# Altium schematic sheet 01.LemonAutopilot_1.SchDoc
size A4
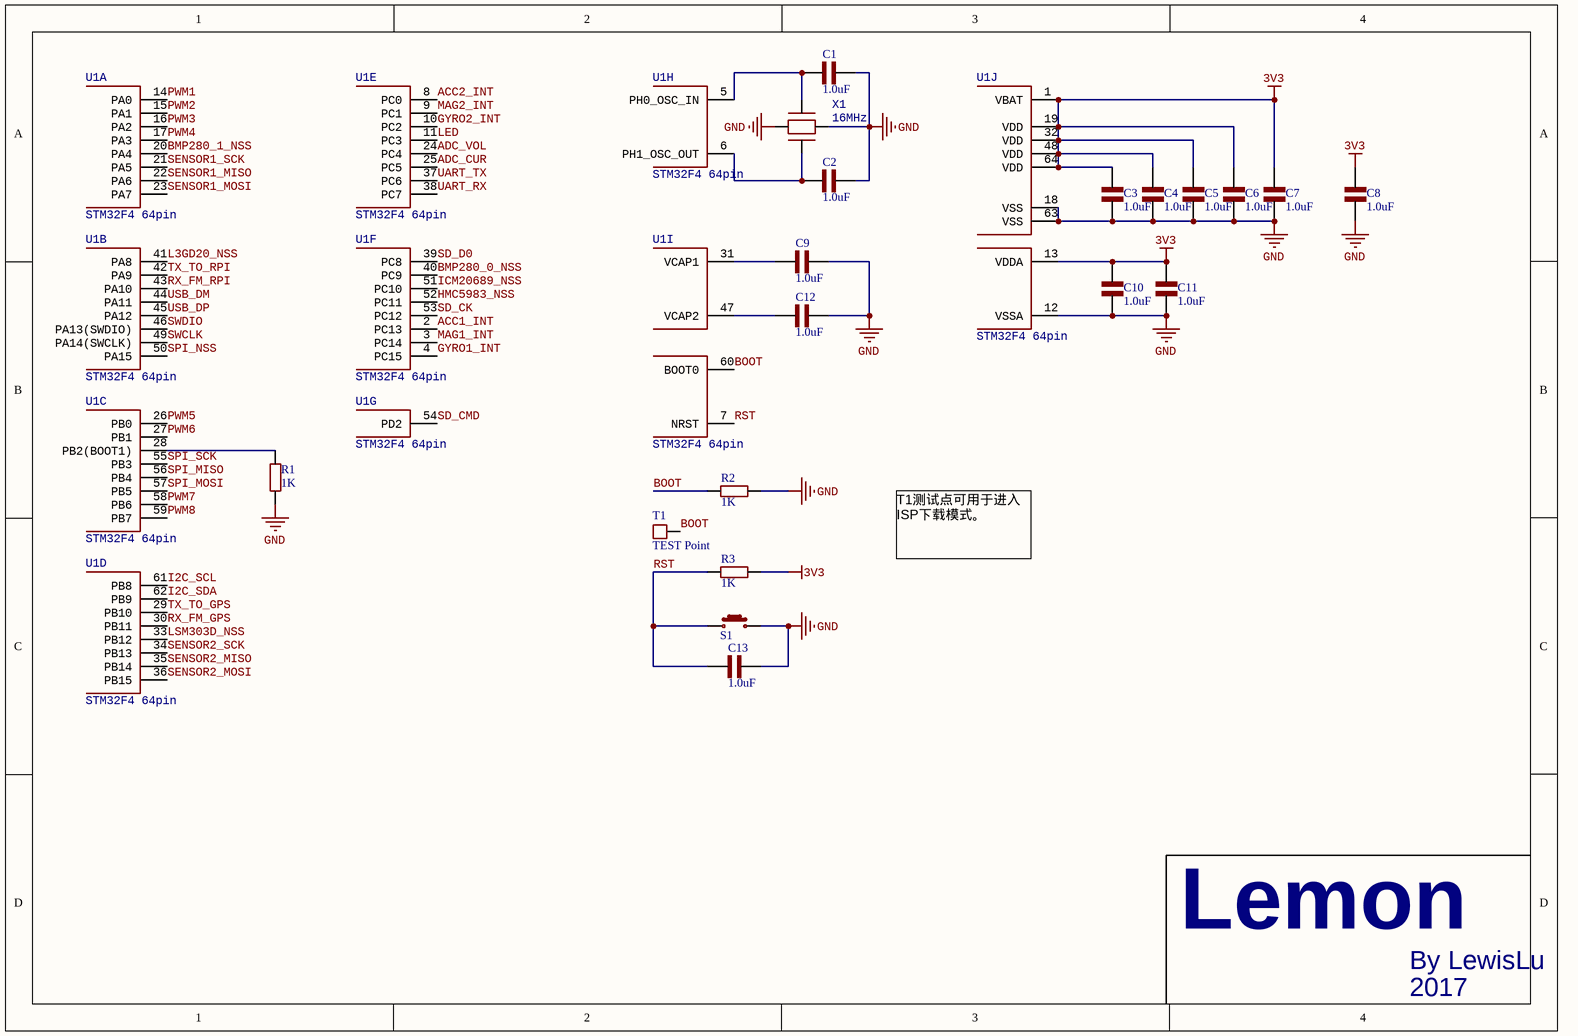
[diagram p0: 01.LemonAutopilot_1.SchDoc]

## Parts
C1  1.0uF  [0603_C]
C2  1.0uF  [0603_C]
C3  1.0uF  [0603_C]
C4  1.0uF  [0603_C]
C5  1.0uF  [0603_C]
C6  1.0uF  [0603_C]
C7  1.0uF  [0603_C]
C8  1.0uF  [0603_C]
C9  1.0uF  [0603_C]
C10  1.0uF  [0603_C]
C11  1.0uF  [0603_C]
C12  1.0uF  [0603_C]
C13  1.0uF  [0603_C]
R1  1K  [0603_R]
R2  1K  [0603_R]
R3  1K  [0603_R]
S1  SW  [SW_3*6]  (value not drawn)
T1  TEST Point  [TEST]
U1  STM32F4 64pin  [LQFP-64]  (parts A,B,C,D,E,F,G,H,I,J of 10)
X1  16MHz  [XTAL_3225]

## Nets
3V3: C3.2 C4.2 C5.2 C6.2 C7.2 C8.2 C10.2 C11.2 R3.2 U1.1(VBAT) U1.13(VDDA) U1.19(VDD) U1.32(VDD) U1.48(VDD) U1.64(VDD)
GND: C1.2 C2.2 C3.1 C4.1 C5.1 C6.1 C7.1 C8.1 C9.2 C10.1 C11.1 C12.2 C13.2 R1.2 R2.2 S1.2 U1.12(VSSA) U1.18(VSS) U1.63(VSS) X1.2 X1.4
ACC1_INT: U1.2(PC13)
ACC2_INT: U1.8(PC0)
ADC_CUR: U1.25(PC5)
ADC_VOL: U1.24(PC4)
BMP280_0_NSS: U1.40(PC9)
BMP280_1_NSS: U1.20(PA4)
BOOT: R2.1 T1.0(TEST) U1.60(BOOT0)
GYRO1_INT: U1.4(PC15)
GYRO2_INT: U1.10(PC2)
HMC5983_NSS: U1.52(PC11)
I2C_SCL: U1.61(PB8)
I2C_SDA: U1.62(PB9)
ICM20689_NSS: U1.51(PC10)
L3GD20_NSS: U1.41(PA8)
LED: U1.11(PC3)
LSM303D_NSS: U1.33(PB12)
MAG1_INT: U1.3(PC14)
MAG2_INT: U1.9(PC1)
PWM1: U1.14(PA0)
PWM2: U1.15(PA1)
PWM3: U1.16(PA2)
PWM4: U1.17(PA3)
PWM5: U1.26(PB0)
PWM6: U1.27(PB1)
PWM7: U1.58(PB6)
PWM8: U1.59(PB7)
RST: C13.1 R3.1 S1.1 U1.7(NRST)
RX_FM_GPS: U1.30(PB11)
RX_FM_RPI: U1.43(PA10)
SD_CK: U1.53(PC12)
SD_CMD: U1.54(PD2)
SD_D0: U1.39(PC8)
SENSOR1_MISO: U1.22(PA6)
SENSOR1_MOSI: U1.23(PA7)
SENSOR1_SCK: U1.21(PA5)
SENSOR2_MISO: U1.35(PB14)
SENSOR2_MOSI: U1.36(PB15)
SENSOR2_SCK: U1.34(PB13)
SPI_MISO: U1.56(PB4)
SPI_MOSI: U1.57(PB5)
SPI_NSS: U1.50(PA15)
SPI_SCK: U1.55(PB3)
SWCLK: U1.49(PA14(SWCLK))
SWDIO: U1.46(PA13(SWDIO))
TX_TO_GPS: U1.29(PB10)
TX_TO_RPI: U1.42(PA9)
UART_RX: U1.38(PC7)
UART_TX: U1.37(PC6)
USB_DM: U1.44(PA11)
USB_DP: U1.45(PA12)
NetC1_1: C1.1 U1.5(PH0_OSC_IN) X1.1
NetC2_1: C2.1 U1.6(PH1_OSC_OUT) X1.3
NetC9_1: C9.1 U1.31(VCAP1)
NetC12_1: C12.1 U1.47(VCAP2)
NetR1_1: R1.1 U1.28(PB2(BOOT1))

## Notes on the sheet
- T1测试点可用于进入ISP下载模式。
- Lemon
- By LewisLu
- 2017

## Library data of the parts
C1-C13 = C0603
R1-R3 = R0603
S1 = S2
T1 = TEST
U1 = STM32F40XRX: MCU ARM 1MB FLASH 64LQFP
X1 = XTAL_16MHz